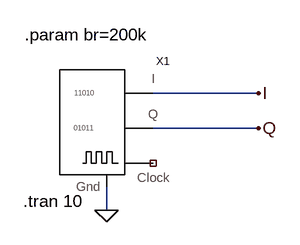
[diagram p0: schematic main.asc]
main.asc, the LTspice schematic file:
Version 4
SHEET 1 880 680
WIRE -560 -48 -704 -48
WIRE -560 0 -704 0
WIRE -768 112 -768 80
FLAG -768 112 0
FLAG -560 -48 I
FLAG -560 0 Q
SYMBOL source_signal_random_NRZ2 -752 16 R0
SYMATTR InstName X1
TEXT -880 -128 Left 2 !.param br=200k
TEXT -882 100 Left 2 !.tran 10

The netlist it stands for:
* main.asc
XX1 0 NC_01 Q I source_signal_random_NRZ2  ; pins Gnd Clock Q I
.param br=200k
.tran 10
.backanno
.end